# EAGLE schematic Logic_board (EAGLE 7.6.0)
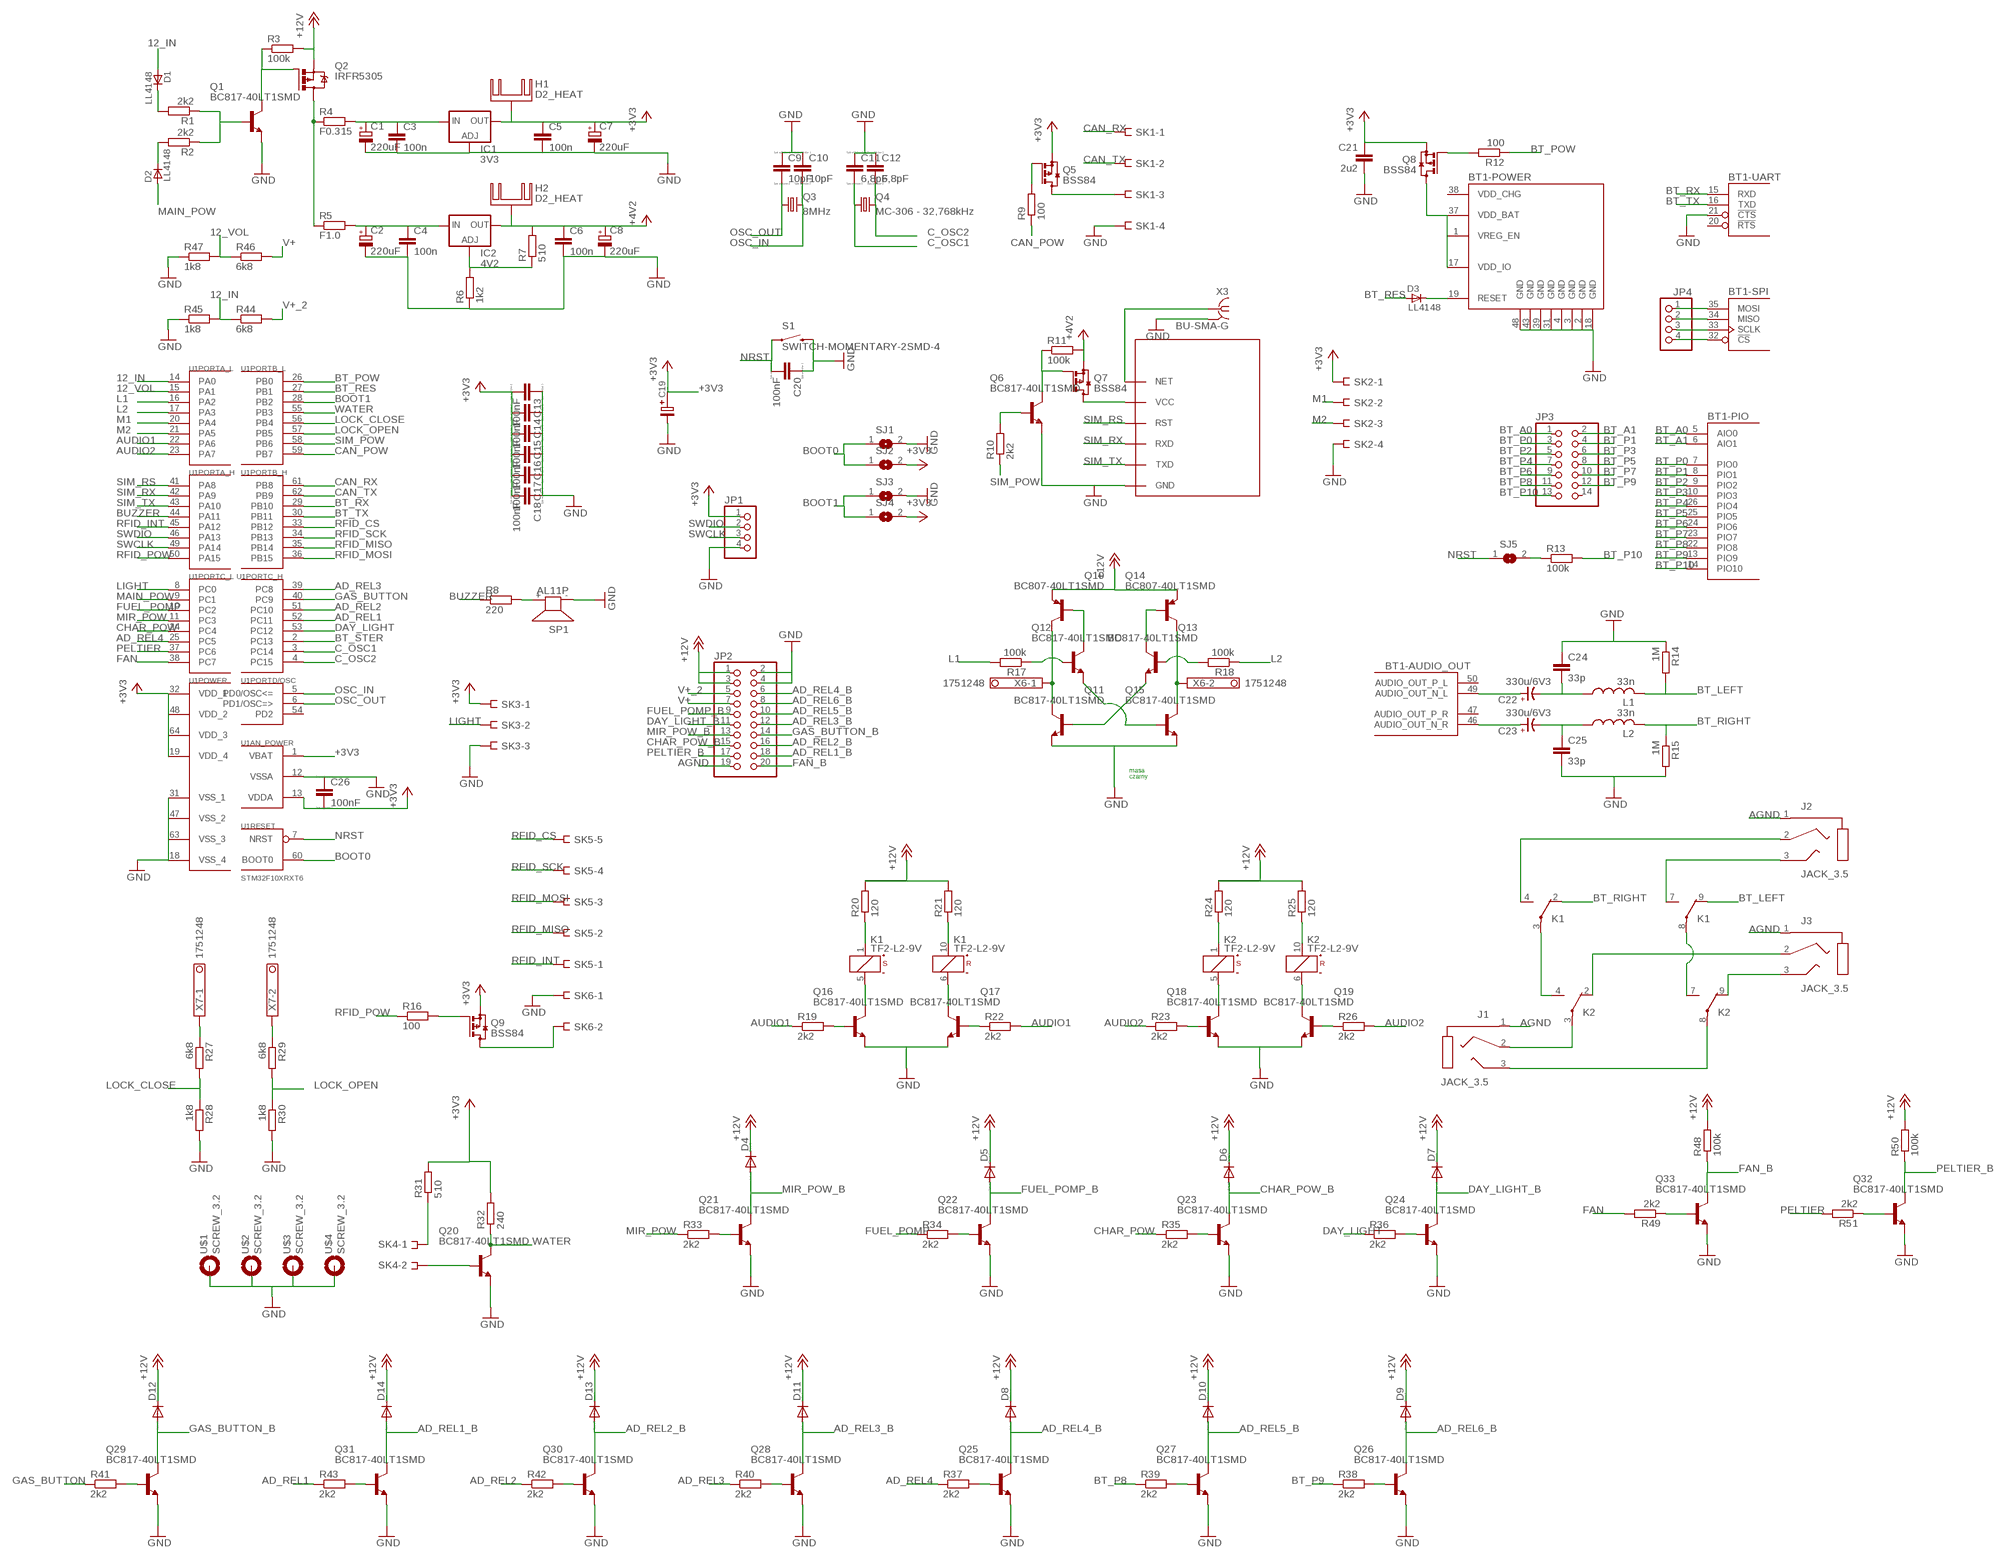
[diagram p0: schematic, sheet 1]

## Parts
BT1  WT32I  [WT32I]
C1  220uF  CPOL-EUD  [PANASONIC_D]
C2  220uF  CPOL-EUD  [PANASONIC_D]
C3  100n  C-EUC2012  [C2012]
C4  100n  C-EUC2012  [C2012]
C5  100n  C-EUC2012  [C2012]
C6  100n  C-EUC2012  [C2012]
C7  220uF  CPOL-EUD  [PANASONIC_D]
C8  220uF  CPOL-EUD  [PANASONIC_D]
C9  10pF  CC2012  [C2012]
C10  10pF  CC2012  [C2012]
C11  6,8pF  CC2012  [C2012]
C12  6,8pF  CC2012  [C2012]
C13  100nF  CC2012  [C2012]
C14  100nF  CC2012  [C2012]
C15  100nF  CC2012  [C2012]
C16  100nF  CC2012  [C2012]
C17  100nF  CC2012  [C2012]
C18  100nF  CC2012  [C2012]
C19  CAP-13,5  [PAC-G-1]
C20  100nF  CC2012  [C2012]
C21  2u2  C-EUC2012  [C2012]
C22  330u/6V3  CP-7343  [7343/T]
C23  330u/6V3  CP-7343  [7343/T]
C24  33p  C-EUC2012  [C2012]
C25  33p  C-EUC2012  [C2012]
C26  100nF  CC2012  [C2012]
D1  LL4148  [SOD80_DO213AA_MINIMELF]
D2  LL4148  [SOD80_DO213AA_MINIMELF]
D3  LL4148  [SOD80_DO213AA_MINIMELF]
D4  DIODE-DO-214AC  [DO-214AC]
D5  DIODE-DO-214AC  [DO-214AC]
D6  DIODE-DO-214AC  [DO-214AC]
D7  DIODE-DO-214AC  [DO-214AC]
D8  DIODE-DO-214AC  [DO-214AC]
D9  DIODE-DO-214AC  [DO-214AC]
D10  DIODE-DO-214AC  [DO-214AC]
D11  DIODE-DO-214AC  [DO-214AC]
D12  DIODE-DO-214AC  [DO-214AC]
D13  DIODE-DO-214AC  [DO-214AC]
D14  DIODE-DO-214AC  [DO-214AC]
H1  D2_HEAT  [D2PACK_HEATSINK]
H2  D2_HEAT  [D2PACK_HEATSINK]
IC1  3V3  LM317BD2T  [D2PACK]
IC2  4V2  LM317BD2T  [D2PACK]
J1  JACK_3.5  [STX3100]
J2  JACK_3.5  [STX3100]
J3  JACK_3.5  [STX3100]
JP1  PINHD-1X4  [1X04]
JP2  PINHD-2X10  [2X10]
JP3  PINHD-2X7  [2X07]
JP4  PINHD-1X4  [1X04]
K1  TF2-L2-9V  [TF2]
K2  TF2-L2-9V  [TF2]
L1  33n  L-USL2012C  [L2012C]
L2  33n  L-USL2012C  [L2012C]
Q1  BC817-40LT1SMD  [SOT23-BEC]
Q2  IRFR5305  [D-PAK_TO252AA]
Q3  8MHz  CRYSTALHC49UP  [HC49UP]
Q4  MC-306 - 32,768kHz  MC-306  [MC-306]
Q5  BSS84  [SOT23]
Q6  BC817-40LT1SMD  [SOT23-BEC]
Q7  BSS84  [SOT23]
Q8  BSS84  [SOT23]
Q9  BSS84  [SOT23]
Q10  BC807-40LT1SMD  [SOT23-BEC]
Q11  BC817-40LT1SMD  [SOT23-BEC]
Q12  BC817-40LT1SMD  [SOT23-BEC]
Q13  BC817-40LT1SMD  [SOT23-BEC]
Q14  BC807-40LT1SMD  [SOT23-BEC]
Q15  BC817-40LT1SMD  [SOT23-BEC]
Q16  BC817-40LT1SMD  [SOT23-BEC]
Q17  BC817-40LT1SMD  [SOT23-BEC]
Q18  BC817-40LT1SMD  [SOT23-BEC]
Q19  BC817-40LT1SMD  [SOT23-BEC]
Q20  BC817-40LT1SMD  [SOT23-BEC]
Q21  BC817-40LT1SMD  [SOT23-BEC]
Q22  BC817-40LT1SMD  [SOT23-BEC]
Q23  BC817-40LT1SMD  [SOT23-BEC]
Q24  BC817-40LT1SMD  [SOT23-BEC]
Q25  BC817-40LT1SMD  [SOT23-BEC]
Q26  BC817-40LT1SMD  [SOT23-BEC]
Q27  BC817-40LT1SMD  [SOT23-BEC]
Q28  BC817-40LT1SMD  [SOT23-BEC]
Q29  BC817-40LT1SMD  [SOT23-BEC]
Q30  BC817-40LT1SMD  [SOT23-BEC]
Q31  BC817-40LT1SMD  [SOT23-BEC]
Q32  BC817-40LT1SMD  [SOT23-BEC]
Q33  BC817-40LT1SMD  [SOT23-BEC]
R1  2k2  R-EU_R0805  [R0805]
R2  2k2  R-EU_R0805  [R0805]
R3  100k  R-EU_R0805  [R0805]
R4  F0.315  R-EU_R2512  [R2512]
R5  F1.0  R-EU_R2512  [R2512]
R6  1k2  R-EU_R0805  [R0805]
R7  510  R-EU_R0805  [R0805]
R8  220  R-EU_R0805  [R0805]
R9  100  R-EU_R0805  [R0805]
R10  2k2  R-EU_R0805  [R0805]
R11  100k  R-EU_R0805  [R0805]
R12  100  R-EU_R0805  [R0805]
R13  100k  R-EU_R0805  [R0805]
R14  1M  R-EU_R0805  [R0805]
R15  1M  R-EU_R0805  [R0805]
R16  100  R-EU_R0805  [R0805]
R17  100k  R-EU_R0805  [R0805]
R18  100k  R-EU_R0805  [R0805]
R19  2k2  R-EU_R0805  [R0805]
R20  120  R-EU_R0805  [R0805]
R21  120  R-EU_R0805  [R0805]
R22  2k2  R-EU_R0805  [R0805]
R23  2k2  R-EU_R0805  [R0805]
R24  120  R-EU_R0805  [R0805]
R25  120  R-EU_R0805  [R0805]
R26  2k2  R-EU_R0805  [R0805]
R27  6k8  R-EU_R0805  [R0805]
R28  1k8  R-EU_R0805  [R0805]
R29  6k8  R-EU_R0805  [R0805]
R30  1k8  R-EU_R0805  [R0805]
R31  510  R-EU_R0805  [R0805]
R32  240  R-EU_R0805  [R0805]
R33  2k2  R-EU_R0805  [R0805]
R34  2k2  R-EU_R0805  [R0805]
R35  2k2  R-EU_R0805  [R0805]
R36  2k2  R-EU_R0805  [R0805]
R37  2k2  R-EU_R0805  [R0805]
R38  2k2  R-EU_R0805  [R0805]
R39  2k2  R-EU_R0805  [R0805]
R40  2k2  R-EU_R0805  [R0805]
R41  2k2  R-EU_R0805  [R0805]
R42  2k2  R-EU_R0805  [R0805]
R43  2k2  R-EU_R0805  [R0805]
R44  6k8  R-EU_R0805  [R0805]
R45  1k8  R-EU_R0805  [R0805]
R46  6k8  R-EU_R0805  [R0805]
R47  1k8  R-EU_R0805  [R0805]
R48  100k  R-EU_R0805  [R0805]
R49  2k2  R-EU_R0805  [R0805]
R50  100k  R-EU_R0805  [R0805]
R51  2k2  R-EU_R0805  [R0805]
S1  SWITCH-MOMENTARY-2SMD-4  [TACTILE_SWITCH_TALL]
SJ1  SJ  [SJ]
SJ2  SJ  [SJ]
SJ3  SJ  [SJ]
SJ4  SJ  [SJ]
SJ5  SJ  [SJ]
SK1  DF3-04S  [DF3S-04]
SK2  DF3-04S  [DF3S-04]
SK3  DF3-03S  [DF3S-03]
SK4  DF3-02S  [DF3S-02]
SK5  DF3-05S  [DF3S-05]
SK6  DF3-02S  [DF3S-02]
SP1  AL11P  [AL11P]
U1  STM32F10XRXT6  [TQFP64]
U2  SIM800L  [SIM-CORE]
U$1  SCREW_3.2  [3,2-PAD]
U$2  SCREW_3.2  [3,2-PAD]
U$3  SCREW_3.2  [3,2-PAD]
U$4  SCREW_3.2  [3,2-PAD]
X3  BU-SMA-G  [BU-SMA-G]
X6  1751248  [1751248]
X7  1751248  [1751248]

## Nets
4V2: Q7.3(D) U2.VCC
12_IN: D1.A R44.1 R45.2 U1.14(PORTA_L:PA0)
12_VOL: R46.1 R47.2 U1.15(PORTA_L:PA1)
+3V3: C5.1 C7.+ C13.2 C14.2 C15.2 C16.2 C17.2 C18.2 C19.+ C21.1 C26.2 H1.1(K) IC1.2(OUT) JP1.1 Q5.2(S) Q8.2(S) Q9.2(S) R31.2 R32.2 SJ2.2 SJ4.2 SK2.1 SK3.1 U1.1(AN_POWER:VBAT) U1.13(AN_POWER:VDDA) U1.19(POWER:VDD_4) U1.32(POWER:VDD_1) U1.48(POWER:VDD_2) U1.64(POWER:VDD_3)
+12V: D4.C D5.C D6.C D7.C D8.C D9.C D10.C D11.C D12.C D13.C D14.C JP2.1 JP2.3 Q2.3(S) Q10.E Q14.E R3.2 R20.2 R21.2 R24.2 R25.2 R48.2 R50.2
AD_REL1: R43.1 U1.52(PORTC_H:PC11)
AD_REL1_B: D14.A JP2.18 Q31.C
AD_REL2: R42.1 U1.51(PORTC_H:PC10)
AD_REL2_B: D13.A JP2.16 Q30.C
AD_REL3: R40.1 U1.39(PORTC_H:PC8)
AD_REL3_B: D11.A JP2.12 Q28.C
AD_REL4: R37.1 U1.25(PORTC_L:PC5)
AD_REL4_B: D8.A JP2.6 Q25.C
AD_REL5_B: D10.A JP2.10 Q27.C
AD_REL6_B: D9.A JP2.8 Q26.C
AGND: J1.1 J2.1 J3.1 JP2.19
AUDIO1: R19.1 R22.2 U1.22(PORTA_L:PA6)
AUDIO2: R23.1 R26.2 U1.23(PORTA_L:PA7)
BOOT0: SJ1.1 SJ2.1 U1.60(RESET:BOOT0)
BOOT1: SJ3.1 SJ4.1 U1.28(PORTB_L:PB2)
BT_A0: BT1.5(-PIO:AIO0) JP3.1
BT_A1: BT1.6(-PIO:AIO1) JP3.2
BT_LEFT: K1.9(2:O) L1.2 R14.2
BT_P0: BT1.7(-PIO:PIO0) JP3.3
BT_P1: BT1.8(-PIO:PIO1) JP3.4
BT_P2: BT1.9(-PIO:PIO2) JP3.5
BT_P3: BT1.10(-PIO:PIO3) JP3.6
BT_P4: BT1.26(-PIO:PIO4) JP3.7
BT_P5: BT1.25(-PIO:PIO5) JP3.8
BT_P6: BT1.24(-PIO:PIO6) JP3.9
BT_P7: BT1.23(-PIO:PIO7) JP3.10
BT_P8: BT1.22(-PIO:PIO8) JP3.11 R39.1
BT_P9: BT1.13(-PIO:PIO9) JP3.12 R38.1
BT_P10: BT1.14(-PIO:PIO10) JP3.13 R13.2
BT_POW: R12.1 U1.26(PORTB_L:PB0)
BT_RES: D3.A U1.27(PORTB_L:PB1)
BT_RIGHT: K1.2(1:O) L2.2 R15.1
BT_RX: BT1.15(-UART:RXD) U1.29(PORTB_H:PB10)
BT_STER: U1.2(PORTC_H:PC13)
BT_TX: BT1.16(-UART:TXD) U1.30(PORTB_H:PB11)
BUZZER: R8.1 U1.44(PORTA_H:PA11)
C_OSC1: C11.2 Q4.1 U1.3(PORTC_H:PC14)
C_OSC2: C12.2 Q4.4 U1.4(PORTC_H:PC15)
CAN_POW: R9.1 U1.59(PORTB_L:PB7)
CAN_RX: SK1.1 U1.61(PORTB_H:PB8)
CAN_TX: SK1.2 U1.62(PORTB_H:PB9)
CHAR_POW: R35.1 U1.24(PORTC_L:PC4)
CHAR_POW_B: D6.A JP2.15 Q23.C
DAY_LIGHT: R36.1 U1.53(PORTC_H:PC12)
DAY_LIGHT_B: D7.A JP2.11 Q24.C
FAN: R49.2 U1.38(PORTC_L:PC7)
FAN_B: JP2.20 Q33.C R48.1
FUEL_POMP: R34.1 U1.10(PORTC_L:PC2)
FUEL_POMP_B: D5.A JP2.9 Q22.C
GAS_BUTTON: R41.1 U1.40(PORTC_H:PC9)
GAS_BUTTON_B: D12.A JP2.14 Q29.C
GND: BT1.2(-POWER:GND) BT1.3(-POWER:GND) BT1.4(-POWER:GND) BT1.18(-POWER:GND) BT1.21(-UART:!CTS) BT1.31(-POWER:GND) BT1.39(-POWER:GND) BT1.43(-POWER:GND) BT1.48(-POWER:GND) C1.- C2.- C3.2 C4.2 C5.2 C6.2 C7.- C8.- C9.1 C10.1 C11.1 C12.1 C13.1 C14.1 C15.1 C16.1 C17.1 C18.1 C19.- C20.1 C21.2 C24.1 C25.2 C26.1 IC1.1(ADJ) JP1.4 JP2.2 JP2.4 Q1.E Q6.E Q11.E Q15.E Q16.E Q17.E Q18.E Q19.E Q20.E Q21.E Q22.E Q23.E Q24.E Q25.E Q26.E Q27.E Q28.E Q29.E Q30.E Q31.E Q32.E Q33.E R6.1 R14.1 R15.2 R28.2 R30.2 R45.1 R47.1 S1.B2 SJ1.2 SJ3.2 SK1.4 SK2.4 SK3.3 SK6.1 SP1.- U1.12(AN_POWER:VSSA) U1.18(POWER:VSS_4) U1.31(POWER:VSS_1) U1.47(POWER:VSS_2) U1.63(POWER:VSS_3) U2.GND U$1.B3,2(MOUNT) U$2.B3,2(MOUNT) U$3.B3,2(MOUNT) U$4.B3,2(MOUNT) X3.2 X3.3 X3.4 X3.5
L1: R17.2 U1.16(PORTA_L:PA2)
L2: R18.1 U1.17(PORTA_L:PA3)
LIGHT: SK3.2 U1.8(PORTC_L:PC0)
LOCK_CLOSE: R27.2 R28.1 U1.56(PORTB_L:PB4)
LOCK_OPEN: R29.2 R30.1 U1.57(PORTB_L:PB5)
M1: SK2.2 U1.20(PORTA_L:PA4)
M2: SK2.3 U1.21(PORTA_L:PA5)
MAIN_POW: D2.A U1.9(PORTC_L:PC1)
MIR_POW: R33.1 U1.11(PORTC_L:PC3)
MIR_POW_B: D4.A JP2.13 Q21.C
N$1: Q5.1(G) R9.2
N$2: Q5.3(D) SK1.3
N$3: R27.1 X7.1
N$4: Q14.C Q15.C X6.2
N$5: Q10.C Q11.C X6.1
N$6: R29.1 X7.2
N$7: Q10.B Q12.C
N$8: Q13.C Q14.B
N$9: Q11.B Q13.E
N$10: D1.C R1.2
N$11: R8.2 SP1.+
N$12: Q6.C Q7.1(G) R11.1
N$13: Q8.1(G) R12.2
N$14: IC2.1(ADJ) R6.2 R7.1
N$15: Q6.B R10.2
N$16: BT1.19(-POWER:RESET) D3.C
N$17: Q22.B R34.2
N$18: BT1.1(-POWER:VREG_EN) BT1.17(-POWER:VDD_IO) BT1.37(-POWER:VDD_BAT) Q8.3(D)
N$19: BT1.35(-SPI:MOSI) JP4.1
N$20: R31.1 SK4.1
N$21: Q9.3(D) SK6.2
N$22: K2.1(S:+) R24.1
N$23: Q12.B R17.1
N$24: Q20.B SK4.2
N$25: Q13.B R18.2
N$26: Q12.E Q15.B
N$27: Q9.1(G) R16.2
N$28: Q21.B R33.2
N$29: BT1.34(-SPI:MISO) JP4.2
N$30: K2.10(R:+) R25.1
N$31: K2.5(S:-) Q18.C
N$32: K2.6(R:-) Q19.C
N$33: Q18.B R23.2
N$34: K1.1(S:+) R20.1
N$35: K1.10(R:+) R21.1
N$36: K1.5(S:-) Q16.C
N$37: K1.6(R:-) Q17.C
N$38: Q16.B R19.2
N$39: BT1.33(-SPI:SCLK) JP4.3
N$40: Q2.4(D) R4.1 R5.1
N$41: Q17.B R22.1
N$42: BT1.32(-SPI:!CS) JP4.4
N$43: Q1.B R1.1 R2.1
N$44: Q1.C Q2.1(G) R3.1
N$45: D2.C R2.2
N$46: C1.+ C3.1 IC1.3(IN) R4.2
N$47: BT1.49(-AUDIO_OUT:AUDIO_OUT_N_L) C22.+
N$48: BT1.46(-AUDIO_OUT:AUDIO_OUT_N_R) C23.+
N$49: C2.+ C4.1 IC2.3(IN) R5.2
N$50: Q19.B R26.1
N$51: C22.- C24.2 L1.1
N$52: C23.- C25.1 L2.1
N$53: R13.1 SJ5.2
N$54: J2.3 K1.7(2:S)
N$55: Q28.B R40.2
N$56: J2.2 K1.4(1:S)
N$57: J1.2 K2.3(1:P)
N$58: J1.3 K2.8(2:P)
N$59: Q23.B R35.2
N$60: U2.NET X3.1
N$61: Q24.B R36.2
N$63: Q25.B R37.2
N$64: Q33.B R49.1
N$66: Q32.B R51.1
N$68: Q26.B R38.2
N$70: Q29.B R41.2
N$72: Q27.B R39.2
N$75: Q30.B R42.2
N$77: Q31.B R43.2
N$91: J3.2 K2.2(1:O)
N$92: J3.3 K2.9(2:O)
N$93: K1.8(2:P) K2.7(2:S)
N$94: K1.3(1:P) K2.4(1:S)
NRST: C20.2 S1.A2 SJ5.1 U1.7(RESET:NRST)
OSC_IN: C10.2 Q3.2 U1.5(PORTD/OSC:PD0/OSC<=)
OSC_OUT: C9.2 Q3.1 U1.6(PORTD/OSC:PD1/OSC=>)
PELTIER: R51.2 U1.37(PORTC_L:PC6)
PELTIER_B: JP2.17 Q32.C R50.1
RFID_CS: SK5.5 U1.33(PORTB_H:PB12)
RFID_INT: SK5.1 U1.45(PORTA_H:PA12)
RFID_MISO: SK5.2 U1.35(PORTB_H:PB14)
RFID_MOSI: SK5.3 U1.36(PORTB_H:PB15)
RFID_POW: R16.1 U1.50(PORTA_H:PA15)
RFID_SCK: SK5.4 U1.34(PORTB_H:PB13)
SIM_POW: R10.1 U1.58(PORTB_L:PB6)
SIM_RS: U1.41(PORTA_H:PA8) U2.RST
SIM_RX: U1.42(PORTA_H:PA9) U2.RXD
SIM_TX: U1.43(PORTA_H:PA10) U2.TXD
SWCLK: JP1.3 U1.49(PORTA_H:PA14)
SWDIO: JP1.2 U1.46(PORTA_H:PA13)
V+: JP2.7 R46.2
V+_2: JP2.5 R44.2
VCC: C6.1 C8.+ H2.1(K) IC2.2(OUT) Q7.2(S) R7.2 R11.2 ; supply symbol labelled +4V2
WATER: Q20.C R32.1 U1.55(PORTB_L:PB3)
Unconnected: BT1.11(-USB:USB_D-) BT1.12(-USB:USB_D+) BT1.20(-UART:!RTS) BT1.27(-PCM:PCM_IN) BT1.28(-PCM:PCM_OUT) BT1.29(-PCM:PCM_SYNC) BT1.30(-PCM:PCM_CLK) BT1.36(-LED:LED) BT1.40(-AUDIO_IN:MIC_BIAS) BT1.41(-AUDIO_IN:AUDIO_IN_P_R) BT1.42(-AUDIO_IN:AUDIO_IN_N_R) BT1.44(-AUDIO_IN:AUDIO_IN_P_L) BT1.45(-AUDIO_IN:AUDIO_IN_N_L) BT1.47(-AUDIO_OUT:AUDIO_OUT_P_R) BT1.50(-AUDIO_OUT:AUDIO_OUT_P_L) JP3.14 U1.54(PORTD/OSC:PD2)

## Notes on the sheet
- masa
  czarny

## Power pins joined to a net without a drawn wire
VDD_CHG: BT1.38(-POWER:VDD_CHG)

## Library data of the parts
BT1 = bluegiga_wt32i:WT32I: BlueGiga WT32i Bluetooth I2S Audio Module
C1 C2 C7 C8 = resistor:CPOL-EU: POLARIZED CAPACITOR, European symbol
C3-C6 C21 C24 C25 = resistor:C-EU: CAPACITOR, European symbol
C9-C18 C20 C26 = eagle-ltspice:C: CAPACITOR, European symbol; SPICEMODEL: NONE; SPICEPREFIX: C
C19 = Cap-Gold:CAP-13,5
C22 C23 = cap-master:CP-: POLARIZED CAP
D1-D3 = _hhn_diodes_smd:LL4148: 1N4148 General Purpose Rectifie SMD-Version of 1N4148 Case: SOD 80 = DO 213 AA = MINIMELF (Glass) Author: Dipl.-Ing. FH Rainer Bayer HHN Hochschule Heilbronn, rainer.bayer@hs-heilbronn.de Ingenieurbüro ing-rb, mail@ing-rb.de
D4-D14 = diode:DIODE-: DIODE
H1 H2 = Stworzone:D2_HEAT
IC1 IC2 = v-reg:LM317?*: 500 mA Adjustable Output Positive Voltage Regulator Source: http://www.onsemi.co.jp .. LM317M-D.PDF
J1-J3 = Stworzone:JACK_3.5
JP1 JP4 = pinhead:PINHD-1X4: PIN HEADER
JP2 = pinhead:PINHD-2X10: PIN HEADER
JP3 = pinhead:PINHD-2X7: PIN HEADER
K1 K2 = relay:TF2-L2*: SMALL POLARIZED RELAY WITH HIGH SENSITIVITY NAiS 2 coil latching Source: http://www.mew-europe.com/.. en_ds_61017_0000.pdf; OC_FARNELL: unknown; OC_NEWARK: unknown
L1 L2 = rcl:L-US: INDUCTOR, American symbol
Q1 Q6 Q11-Q13 Q15-Q33 = transistor-npn:BC817*: NPN Transistor
Q2 = transistor-power:IRF?5305: HEXFET Power MOSFET Source: http://www.irf.com/product-info/datasheets/data/irfr5305pbf.pdf
Q3 = crystal:CRYSTAL: CRYSTAL; OC_FARNELL: unknown; OC_NEWARK: unknown
Q4 = crystal:MC-306: kHz RANGE CRYSTAL UNIT SMD Source: MC-306_405_406_E07X.PDF Homepage <http://www.epsontoyocom.co.jp>; MPN: MC-306 60.0KHZ 100PPM ,12.5PF; OC_FARNELL: 1278040; OC_NEWARK: 31M5576
Q5 Q7-Q9 = transistor-small-signal:BSS84: P-CHANNEL MOS FET
Q10 Q14 = transistor-pnp:BC807*: PNP Transistror
R1-R51 = resistor:R-EU_: RESISTOR, European symbol
S1 = SparkFun-Electromechanical:SWITCH-MOMENTARY-2: Various NO switches- pushbuttons, reed, etc; PROD_ID: SWCH-11966
SJ1-SJ5 = jumper:SJ: SMD solder JUMPER
SK1 SK2 = con-hirose-df3:DF3-04S: Single row female connector 2mm 4 way
SK3 = con-hirose-df3:DF3-03S: Single row female connector 2mm 3 way
SK4 SK6 = con-hirose-df3:DF3-02S: Single row female connector 2mm 2 way
SK5 = con-hirose-df3:DF3-05S: Single row female connector 2mm 5 way
SP1 = buzzer:AL11P: SPEAKER Source: Buerklin; OC_FARNELL: unknown; OC_NEWARK: unknown
U1 = stm32:STM32F10XRXT6: STM32F101/103 64pin LQFP
U2 = SIM800L:SIM800L
U$1-U$4 = Stworzone:SCREW_3.2
X3 = con-coax:BU-SMA-G: FEMALE SMA CONNECTOR Radiall distributor RS 193-9117; OC_FARNELL: unknown; OC_NEWARK: unknown
X6 X7 = con-phoenix-350:1751248: MKDS 1/ 2-3,5 Printklemme Nennstrom: 10 A Bemessungsspannung: 160 V Raster: 3,5 mm Polzahl: 2 Montageart: Löten Anschlussart: Schraubanschluss Anschlussrichtung vom Leiter zur Platine: 0° Source: http://eshop.phoenixcontact.com .. 1751248.pdf; OC_FARNELL: unknown; OC_NEWARK: unknown